# Altium project Power Distribution Breakout Board.PrjPcb
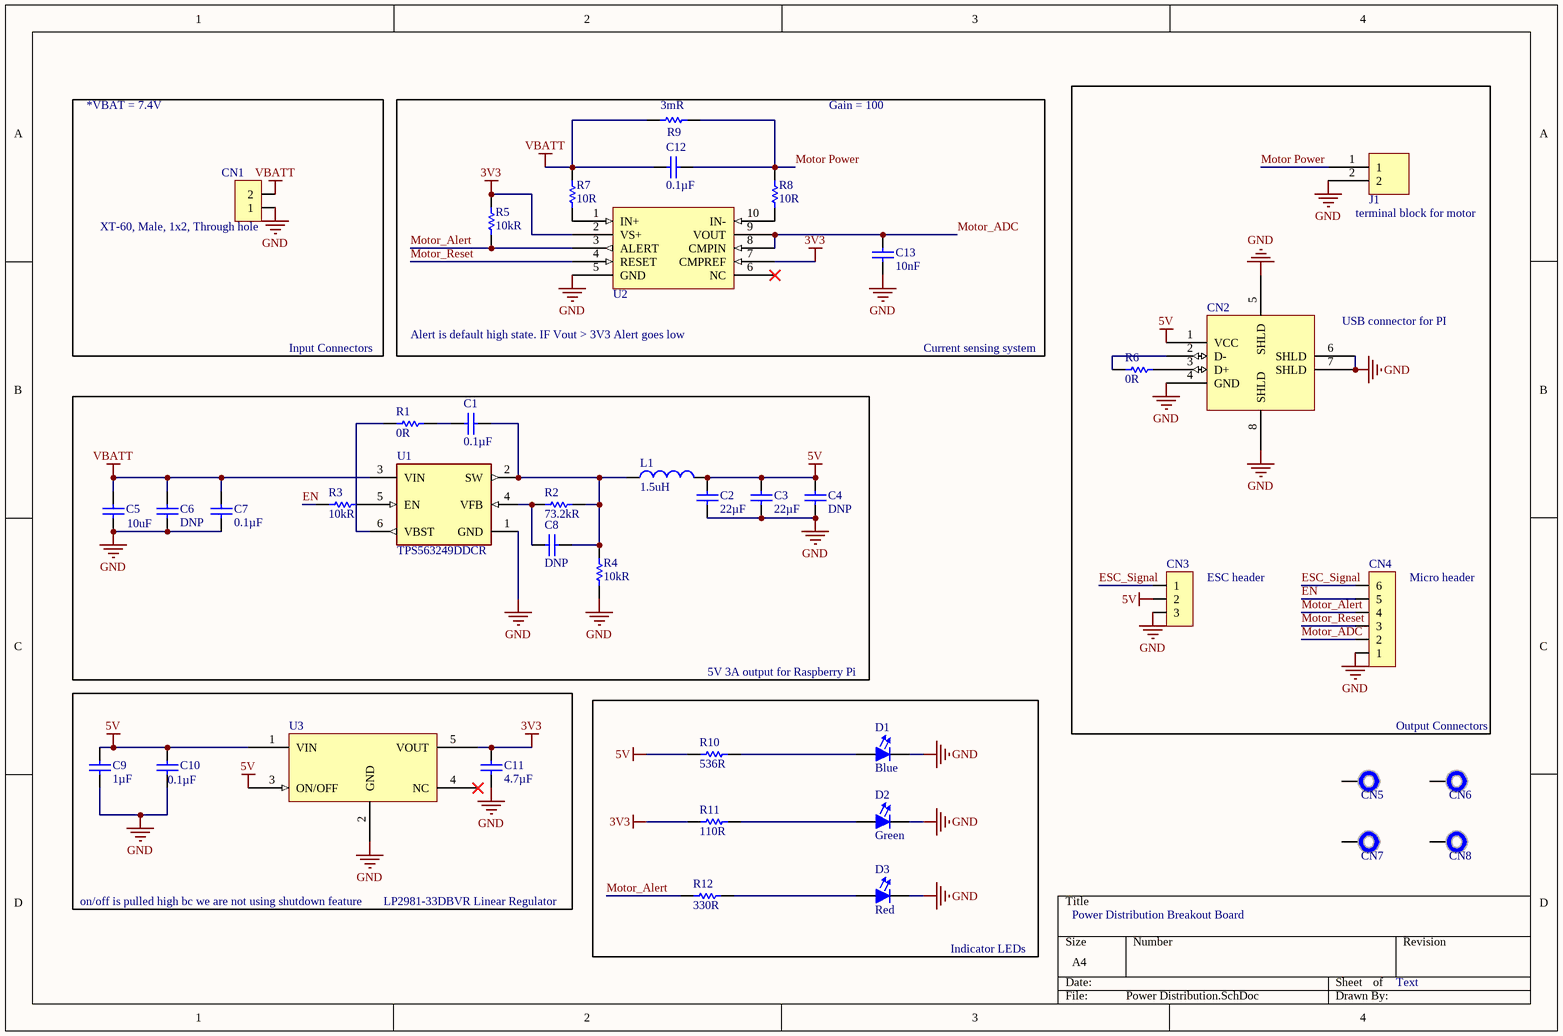
[diagram p0: Power Distribution.SchDoc]
1 sheet, 41 parts. Net scope: global (net labels, ports and power ports of the same name join across sheets).
Board file: PD Breakout.PcbDoc

## Sheet Power Distribution.SchDoc
size A4

### Parts
C1  Capacitance: 0.1µF  [CAPC1608N(0603")]  (hidden comment: 0.1uF, 50V, 10%, X7R, 0603)
C2  value 22µF  [CAPC2012N(0805")]  (hidden comment: 22uF 35V 0805 SMD, Ceramic)
C3  value 22µF  [CAPC2012N(0805")]  (hidden comment: 22uF 35V 0805 SMD, Ceramic)
C4  value DNP  [CAPC1608N(0603")]  (hidden comment: Placeholder_Capacitor_0603)
C5  Capacitance: 10uF  [CAPC2013X12N]  (hidden comment: 10uF, 25V, X5R, 0805)
C6  value DNP  [CAPC3216N(1206")]  (hidden comment: Placeholder_Capacitor_1206)
C7  Capacitance: 0.1µF  [CAPC1608N(0603")]  (hidden comment: 0.1uF, 50V, 10%, X7R, 0603)
C8  value DNP  [CAPC1608N(0603")]  (hidden comment: Placeholder_Capacitor_0603)
C9  value 1µF  [CAPC1608N(0603")]  (hidden comment: 1uF 25V 0603 SMD, Ceramic)
C10  value 0.1µF  [CAPC1608N(0603")]  (hidden comment: 0.1uF 16V 0603 SMD, Ceramic)
C11  value 4.7µF  [CAPC1608N(0603")]  (hidden comment: 4.7uF 10V 0603 SMD, Ceramic)
C12  Capacitance: 0.1µF  [CAPC1608N(0603")]  (hidden comment: 0.1uF, 50V, 10%, X7R, 0603)
C13  value 10nF  [CAPC1608N(0603")]  (hidden comment: 10 nF, 50V 0603 SMD, Ceramic)
CN1  XT-60, Male, 1x2, Through hole  [XT-60 Male]  (no BOM)
CN2  USB - Type A Female  [USB - Type A Female-Footprint-1]  (value not drawn)
CN3  Header, Male, 1x3, Pitch: 0.1" (2.54mm), THT  [Header, Male, 1x3, Pitch: 0.1" (2.54mm),THT]  (value not drawn)
CN4  Header, Male, 1x6  [Header, Male, 1X6]  (value not drawn)
CN5  Plated Hole, 1mm  [PLATED_HOLE_1mm]  (value not drawn)  (no BOM)
CN6  Plated Hole, 1mm  [PLATED_HOLE_1mm]  (value not drawn)  (no BOM)
CN7  Plated Hole, 1mm  [PLATED_HOLE_1mm]  (value not drawn)  (no BOM)
CN8  Plated Hole, 1mm  [PLATED_HOLE_1mm]  (value not drawn)  (no BOM)
D1  Color: Blue  [FP-LB_Q39E-MFG]  (hidden comment: LBQ39E-N1OO-35-1)
D2  Color: Green  [FP-LB_Q39E-MFG]  (hidden comment: LT Q39G-Q1OO-25-1)
D3  Color: Red  [FP-LB_Q39E-MFG]  (hidden comment: LSQ976-NR-1)
J1  2x1 Terminal Block 3.5mm  [2x1 Terminal Block 3.5mm-Footprint-1]  (value not drawn)
L1  Inductance: 1.5uH  [INDC2520X12N]  (hidden comment: DFE252012P-1R5M=P2)
R1  value 0R  [RESC1608N(0603")]  (hidden comment: 0R, 1%, 1/10W, 0603 SMD)
R2  Resistance: 73.2kR  [RESC1608X55X30LL15T15]  (hidden comment: ERJ-3EKF7322V)
R3  Resistance: 10kR  [RESC1608X55X25ML10T15]  (hidden comment: RC0603FR-0710KL)
R4  Resistance: 10kR  [RESC1608X55X25ML10T15]  (hidden comment: RC0603FR-0710KL)
R5  Resistance: 10kR  [RESC1608X55X25ML10T15]  (hidden comment: RC0603FR-0710KL)
R6  value 0R  [RESC1608N(0603")]  (hidden comment: 0R, 1%, 1/10W, 0603 SMD)
R7  Resistance: 10R  [FP-ERJ3EK-IPC_A]  (hidden comment: ERJ3EKF10R0V)
R8  Resistance: 10R  [FP-ERJ3EK-IPC_A]  (hidden comment: ERJ3EKF10R0V)
R9  3mR, 1%, 1W, 1206  [RESC1632X07M]  (value not drawn)
R10  Resistance: 536R  [RESC1608X55X30NL15T15]  (hidden comment: ERJ-3EKF5360V)
R11  Resistance: 110R  [RESC1608X55X25ML10T15]  (hidden comment: RC0603FR-07110RL)
R12  Resistance: 330R  [FP-CRCW0603-e3-IPC_C]  (hidden comment: CRCW0603330RFKEA)
U1  TPS563249DDCR  [FP-DDC0005A-IPC_B]
U2  INA381A3IDGSR  [TSSOP50P490X110-10N]  (value not drawn)
U3  LP2981-33DBVR  [SOT95P280X145-5N]  (value not drawn)

### Blocks framed on the sheet
5V 3A output for Raspberry Pi: C1-C8 L1 R1-R4 U1
Indicator LEDs: D1-D3 R10-R12

### Nets
3V3: C11.2(Cathode) R5.2 R11.1 U2.2(VS+) U2.7(CMPREF) U3.5(VOUT)
5V: C2.2(Cathode) C3.2(Cathode) C4.2(Cathode) C9.2(Cathode) C10.2(Cathode) CN2.1(VCC) CN3.2 L1.2 R10.1 U3.1(VIN) U3.3(ON/OFF)
GND: C2.1(Anode) C3.1(Anode) C4.1(Anode) C5.2 C6.1(Anode) C7.1(Anode) C9.1(Anode) C10.1(Anode) C11.1(Anode) C13.1(Anode) CN1.1 CN2.4(GND) CN2.5(SHLD) CN2.6(SHLD) CN2.7(SHLD) CN2.8(SHLD) CN3.3 CN4.1 D1.1(Cathode) D2.1(Cathode) D3.1(Cathode) J1.2 R4.1 U1.1(GND) U2.5(GND) U3.2(GND)
VBATT: C5.1 C6.2(Cathode) C7.2(Cathode) C12.2(Cathode) CN1.2 R7.2 R9.1 U1.3(VIN)
EN: CN4.5 R3.2
ESC_Signal: CN3.1 CN4.6
Motor Power: C12.1(Anode) J1.1 R8.2 R9.2
Motor_ADC: C13.2(Cathode) CN4.2 U2.8(CMPIN) U2.9(VOUT)
Motor_Alert: CN4.4 R5.1 R12.1 U2.3(ALERT)
Motor_Reset: CN4.3 U2.4(RESET)
NetC1_1: C1.1(Anode) C8.1(Anode) L1.1 R2.2 R4.2 U1.2(SW)
NetC1_2: C1.2(Cathode) R1.2
NetC8_2: C8.2(Cathode) R2.1 U1.4(VFB)
NetCN2_2: CN2.2(D-) R6.1
NetCN2_3: CN2.3(D+) R6.2
NetD1_2: D1.2(Anode) R10.2
NetD2_2: D2.2(Anode) R11.2
NetD3_2: D3.2(Anode) R12.2
NetR1_1: R1.1 U1.6(VBST)
NetR3_1: R3.1 U1.5(EN)
NetR7_1: R7.1 U2.1(IN+)
NetR8_1: R8.1 U2.10(IN-)

Not connected (* = marked no-connect by the designer): CN5 1; CN6 1; CN7 1; CN8 1; U2 6(NC)*; U3 4(NC)*

### Notes on the sheet
- *VBAT = 7.4V
- Gain = 100
- (near J1) terminal block for motor
- Input Connectors
- Alert is default high state. IF Vout > 3V3 Alert goes low
- Current sensing system
- (near CN2) USB connector for PI
- (near CN3) ESC header
- (near CN4) Micro header
- Output Connectors
- on/off is pulled high bc we are not using shutdown feature
- LP2981-33DBVR Linear Regulator
- Power Distribution Breakout Board
- Text

### Library data of the parts
C1 C7 C12 = CMP-006-0007-1: 0.1µF ±10% Ceramic Capacitor X7R 0603 (1608 Metric); Operating Temperature: -55°C ~ 125°C; Pin Count: 2; Design Item ID: 0.1uF, 50V, 10%, X7R, 0603; Package / Case: 0603 (1608 Metric); Source: AUVic_Schematic_Library_Capacitors.SchLib; ComponentLink1URL: https://www.digikey.ca/product-detail/en/tdk-corporation/C1608X7R1H104M080AA/445-5098-1-ND/2093713; ComponentLink1Description: Digi-Key; Mounting Type: Surface Mount, MLCC; Component Type: Standard; Created By: Poorna Chander Kalidas
C2 C3 = CMP-006-0036-1: Capacitor, Ceramic, 35V, +/- 20%, 0805 SMD, X5R; Design Item ID: 22uF 35V 0805 SMD, Ceramic; Source: AUVic_Schematic_Library_Capacitors.SchLib; Pin Count: 2; Component Type: Standard; Publisher: AUVic; PackageDescription: Chip Capacitor; Published: 14-06-01
C4 C8 = CMP-006-0054-1: Placeholder 0603 SMT Footprint; Made By: Ashwin Sira; Date Created: 2016-06-26; Design Item ID: Placeholder_Capacitor_0603; PackageDescription: Chip Capacitor; Component Type: Standard (No BOM); Pin Count: 2; Source: AUVic_Schematic_Library_Capacitors.SchLib; Publisher: AUVic
C5 = CMP-00114-1: 0805 10 uF 25 V ±10% Tolerance X5R SMT Multilayer Ceramic Capacitor; Dielectric: X7R; Max Operating Temperature: 85°C; Resistor Type: Ceramic; Lead Free: Lead Free; Tolerance: 10%; Height: 1.25mm; Package Quantity: 1; Voltage Rating: 25V; Width: 0.049inch; Min Operating Temperature: -55°C; Case Code (Imperial): 0805; Number of Pins: 2; Thickness: 0.053inch; Length: 0.079inch; Case Code (Metric): 2012; Mount: Surface Mount; Case/Package: 0805; Packaging: Tape and Reel; REACH SVHC: No SVHC; Termination: SMD/SMT; Voltage Rating (DC): 25V
C6 = CMP-006-0056-1: Placeholder 1206 SMT Footprint; Made By: Ashwin Sira; PackageDescription: Chip Capacitor; Component Type: Standard (No BOM); Source: AUVic_Schematic_Library_Capacitors.SchLib; Date Created: 2016-06-26; Design Item ID: Placeholder_Capacitor_1206; Pin Count: 2; Publisher: AUVic
C9 = CMP-006-0027-1: Capacitor, Ceramic, 25V, +/- 10%, 0603 SMD, X5R; MFG: Murata-Electronics-North-America; MFG#: GRM188R61E105KA12D; Created By: Andy Bates; Publisher: AUVic; Source: AUVic_Schematic_Library_Capacitors.SchLib; Component Type: Standard; Pin Count: 2; PackageDescription: Chip Capacitor; Design Item ID: 1uF 25V 0603 SMD, Ceramic; Published: 16-06-27
C10 = CMP-006-0005-1: Capacitor, Ceramic, 16V, +/- 10%, 0603 SMD, X7R; Created By: Andy Bates; Published: 16-04-26; PackageDescription: Chip Capacitor; Pin Count: 2; Source: AUVic_Schematic_Library_Capacitors.SchLib; Design Item ID: 0.1uF 16V 0603 SMD, Ceramic; Component Type: Standard; Publisher: AUVic
C11 = CMP-006-0043-1: Capacitor, Ceramic, 10V, +/- 10%, 0603 SMD, X5R; MFG: Samsung; MFG#: GRM188R61A475KE15D; PackageDescription: Chip Capacitor; Source: AUVic_Schematic_Library_Capacitors.SchLib; Published: 16-06-23; Created By: Ashwin Sira; Component Type: Standard; Pin Count: 2; Publisher: AUVic; Design Item ID: 4.7uF 10V 0603 SMD, Ceramic
C13 = CMP-006-0010-1: Capacitor, Ceramic, 50V, +/- 10%, 0603 SMD; MFG: Samsung; MFG#: GRM188R61A475KE15D; Created By: Gabriel; Design Item ID: 10 nF, 50V 0603 SMD, Ceramic; PackageDescription: Chip Capacitor; Source: AUVic_Schematic_Library_Capacitors.SchLib; Published: 16-06-23; Pin Count: 2; Publisher: AUVic; Component Type: Standard
CN1 = CMP-005-0041-1: Date Published: 2016-09-08; Pin Count: 2; Source: AUVic_Schematic_Library_Connectors.SchLib; Component Type: Standard (No BOM); Design Item ID: XT-60, Male, 1x2, Through hole; Publisher: Andy Bates
CN2 = CMP-00116-2: USB - Type A Female USB 2.0 THT; LCSC Part #: C168725; Created By: Miguel Manguerra
CN3 = CMP-005-0025-1: Created By: Ashwin Sira; Pin Count: 3; Component Type: Standard; Design Item ID: Header, Male, 1x3, Pitch: 0.1" (2.54mm), THT; Reviewed By: *; Last Updated: *; Source: AUVic_Schematic_Library_Connectors.SchLib; Publisher: AUVic; Date Published: 2016-03-03
CN4 = CMP-005-0031-1: 1x6, Pads Pitch: 0.1" (2.54mm), Through hole; Made Bates: Andy Bates; Pin Count: 6; Component Type: Standard; Design Item ID: Header, Male, 1x6; Source: AUVic_Schematic_Library_Connectors.SchLib; Supplier 1 Part Number: 952-2270-ND
CN5-CN8 = CMP-054-0000-1: Created By: Ashwin Sira; Design Item ID: Plated Hole, 1mm; Source: AUVic_Integrated_Library_Virtual_Components.SchLib; Publisher: AUVic; Pin Count: 1; Date Created: 2016-07-10; Component Type: Standard (No BOM)
D1 = CMP-00063-3: LED BLUE DIFFUSED 0603 SMD; Luminous Flux: 0.13lm; Lens Size: 0.8mm; Lens Color: White; Viewing Angle: 130°; Luminous Intensity: 42mcd; Number of LEDs: 1; Dominant Wavelength: 470nm; Lens Style: Flat,Diffused,Colorless,Rectangular; Test Current: 5mA; Forward Voltage: 2.85V; Packaging: Tape and Reel; Case/Package: 0603; Height: 0.4mm; Number of Pins: 2; Mount: Surface Mount; Case Code (Metric): 1608; Case Code (Imperial): 0603; Lens Transparency: Diffused; Width: 0.8mm; Length: 1.6mm; Radiation Hardening: No
D2 = CMP-00064-3: LED GREEN DIFFUSED 0603 SMD; Dominant Wavelength: 530nm; Luminous Intensity: 280mcd; Lens Style: Diffused,Colorless,Rectangular; Number of LEDs: 1; Forward Voltage: 2.85V; Test Current: 5mA; Reverse Voltage: 5V; Forward Current: 15mA; Luminous Flux: 0.55lm; Radiation Hardening: No; Packaging: Tape and Reel; Mount: Surface Mount; Max Operating Temperature: 85°C; Number of Elements: 1; Number of Pins: 2; Min Operating Temperature: -40°C; Depth: 0.9mm; Case/Package: SMD/SMT; Length: 1.7mm
D3 = CMP-00066-2: LED Red 645nm 2-Pin Chip 0603(1608Metric) T/R; Lens Transparency: Diffused; Power Dissipation: 65mW; Forward Voltage: 2.5V; Dominant Wavelength: 633nm; Number of Elements: 1; Lens Style: Diffused,Flat,Colorless,Rectangular; Lens Color: White; Viewing Angle: 160°; Luminous Flux: 0.33lm; Test Current: 20mA; Forward Current: 25mA; Luminous Intensity: 180mcd; Reverse Voltage: 12V; Lens Size: 0.8mm; Max Operating Temperature: 85°C; Depth: 0.9mm; Illumination Color: Red; Packaging: Tape and Reel; Min Operating Temperature: -30°C; Case Code (Imperial): 0603; Case Code (Metric): 1608; Number of Pins: 2; Mount: Surface Mount; Height: 0.8mm; Package Quantity: 1; Length: 1.7mm; Width: 0.8mm; Number of LEDs: 1; Case/Package: 0603; Radiation Hardening: No
J1 = CMP-00117-2: P=3.5mm Screw terminal RoHS; Created by: Miguel Manguerra; LCSC Part #: C474892
L1 = CMP-00112-1: Ind Metal Alloy Shielded 1.5uH 20% 1MHz Powdered Iron 2.6A 1008 T/R; Core Material: Ferrite; Current Rating: 3.5A; DC Resistance (DCR): 60mR; Packaging: Tape and Reel; Mount: Surface Mount; Depth: 2mm; Tolerance: 20%; Shielding: Shielded; Test Frequency: 1MHz; Width: 0.079inch; Case Code (Metric): 2520; Min Operating Temperature: -40°C; Resistor Type: Wirewound,Metal Alloy; Length: 0.098inch; Case/Package: 1008; Case Code (Imperial): 1008; Height - Seated (Max): 0.039inch; Max Operating Temperature: 125°C; Max DC Current: 2.6A
R1 R6 = CMP-047-0001-1: Made By: Ashwin Sira; Owned By: AUVic; Component Type: Standard; Design Item ID: 0R, 1%, 1/10W, 0603 SMD; Last Edited: 14-05-31; Created On: 14-05-31; Source: AUVic_Schematic_Library_Resistors.SchLib; Pin Count: 2
R2 = CMP-00029-1: Res Thick Film 0603 73.2K Ohm 1% 0.1W(1/10W) ±100ppm/C Pad SMD Automotive T/R; Max Power Dissipation: 100mW; Voltage Rating (DC): 50V; Temperature Coefficient: 100ppm/°C; Voltage Rating: 75V; Packaging: Tape and Reel; REACH SVHC: No SVHC; Case Code (Imperial): 0603; Mount: Surface Mount; Height: 0.022inch; Military Standard: Not; Features: Automotive AEC-Q200; Power Rating: 100mW; Width: 0.031inch; Termination: SMD/SMT; Number of Terminations: 2; Composition: Thick Film; Length: 1.6mm; Depth: 0.8mm; Min Operating Temperature: -55°C; Package Quantity: 1; Max Operating Temperature: 155°C; Case/Package: 0603; Case Code (Metric): 1608; Tolerance: 1%; Radiation Hardening: No; Contact Plating: Tin; Lead Free: Lead Free
R3-R5 = CMP-00037-1: Res General Purpose Thick Film 0603 10K Ohm 1% 1/10W ±100ppm/°C Molded SMD Paper T/R; Power Rating: 100mW; Voltage Rating (DC): 50V; Voltage Rating: 75V; Case/Package: 0603; Weight: 7.1E-05oz; Case Code (Imperial): 0603; Composition: Thick Film; Depth: 0.8mm; Min Operating Temperature: -55°C; Width: 0.8mm; Height: 0.45mm; Military Standard: Not; Packaging: Tape and Reel; Termination: SMD/SMT; Lead Free: Lead Free; Temperature Coefficient: 100ppm/°C; Number of Pins: 2; Max Operating Temperature: 155°C; Lead Pitch: 0.3mm; REACH SVHC: No SVHC; Case Code (Metric): 1608; Tolerance: 1%; Length: 1.6mm
R7 R8 = CMP-00034-2: PANASONIC - ERJ3EKF10R0V - SMD Chip Resistor, 0603 [1608 Metric], 10 ohm, ERJ3EK Series, 75 V, Thick Film, 100 mW; Temperature Coefficient: 100ppm/°C; Tolerance: 1%; Max Power Dissipation: 100mW; Voltage Rating (DC): 75V; Package Quantity: 5000; Case Code (Imperial): 0603; Military Standard: Not; Depth: 0.8mm; Number of Terminations: 2; Working Voltage: 75V; Min Operating Temperature: -55°C; Width: 0.8mm; Composition: Thick Film; Packaging: Tape and Reel; Power Rating: 100mW; REACH SVHC: No SVHC; Max Operating Temperature: 155°C; Case Code (Metric): 1608; Features: Automotive AEC-Q200; Case/Package: 0603; Length: 1.6mm; Number of Pins: 2; Lead Free: Lead Free; Height: 0.45mm; Voltage Rating: 75V; Contact Plating: Tin; Termination: SMD/SMT; Mount: Surface Mount; Radiation Hardening: No
R9 = CMP-00122-4: 3 mOhms ±1% 1W Chip Resistor Wide 1206 (3216 Metric), 0612; Resistance: 3mR
R10 = CMP-00071-1: SMD Chip Resistor, 0603 [1608 Metric], 536 ohm, ERJ3EK Series, 75 V, Thick Film, 100 mW; Tolerance: 1%; Voltage Rating (DC): 50V; Voltage Rating: 75V; Power Rating: 100mW; Temperature Coefficient: 100ppm/°C; Max Operating Temperature: 155°C; Package Quantity: 1; REACH SVHC: No SVHC; Depth: 0.8mm; Composition: Thick Film; Height: 0.022inch; Packaging: Tape and Reel; Contact Plating: Tin; Lead Free: Lead Free; Length: 1.6mm; Case/Package: 0603; Military Standard: Not; Features: Automotive AEC-Q200; Termination: SMD/SMT; Max Power Dissipation: 100mW; Width: 0.8mm; Mount: Surface Mount; Case Code (Metric): 1608; Case Code (Imperial): 0603; Number of Terminations: 2; Min Operating Temperature: -55°C
R11 = CMP-00069-1: RES SMD 110 OHM 1% 1/10W 0603; Max Power Dissipation: 100mW; Voltage Rating (DC): 50V; Temperature Coefficient: 100ppm/°C; Working Voltage: 75V; Military Standard: Not; Termination: SMD/SMT; Number of Terminations: 2; Features: Moisture Resistant; Min Operating Temperature: -55°C; Power Rating: 100mW; Height: 0.022inch; Package Quantity: 1; Lead Free: Lead Free; Tolerance: 1%; Voltage Rating: 50V; Composition: Thick Film; Case Code (Imperial): 0603; Length: 1.6mm; Packaging: Tape and Reel; Case Code (Metric): 1608; Max Operating Temperature: 155°C; Depth: 0.8mm; Case/Package: 0603; Width: 0.031inch
R12 = CMP-00067-2: Res Thick Film 0603 330 Ohm 1% 0.1W(1/10W) +/-100ppm/ßC Pad SMD Automotive T/R; Voltage Rating (DC): 75V; Power Rating: 100mW; Temperature Coefficient: 100ppm/°C; Contact Plating: Tin; Package Quantity: 10; Tolerance: 1%; Packaging: Tape and Reel; Case/Package: 0603; Max Operating Temperature: 155°C; Case Code (Metric): 1608; Case Code (Imperial): 0603; Min Operating Temperature: -55°C; Length: 1.55mm; Height: 0.45mm; Lead Free: Lead Free; Termination: SMD/SMT; Voltage Rating: 75V; Composition: Thick Film; Weight: 7.1E-05oz; Military Standard: Not; Max Power Dissipation: 100mW; REACH SVHC: Unknown; Mount: Surface Mount; Depth: 0.85mm; Features: Automotive AEC-Q200; Number of Terminations: 2; Radiation Hardening: No; Width: 0.033inch
U1 = CMP-044-0004-1: 17-V, 3-A, constant 1.4-MHz synchronous step-down voltage regulator 6-SOT-23-THIN -40 to 125
U2 = CMP-00120-1: 26V, 350kHz current sense amplifier w/ integrated over-current comparator 10-VSSOP -40 to 125
U3 = CMP-044-0003-2: IC REG LINEAR 3.3V 100MA SOT23-5; Max Input Voltage: 16V; Min Input Voltage: 2.2V; Number of Regulators: 1; Output Voltage Accuracy: 2%; Polarity: Positive; Input Bias Current: 600uA; Output Type: Fixed; Dropout Voltage: 200mV; Package Quantity: 1; REACH SVHC: No SVHC; Output Voltage: 3.3V; Min Operating Temperature: -40°C; Case/Package: SOT-23; Max Output Current: 100mA; Lead Free: Lead Free; Max Operating Temperature: 125°C; Number of Outputs: 1; Number of Pins: 5; Mount: Surface Mount; Accuracy: 2%; Nominal Output Voltage: 3.3V; Output Current: 100mA; Packaging: Tape and Reel; Quiescent Current: 600uA; Radiation Hardening: No; Contact Plating: Tin,Matte